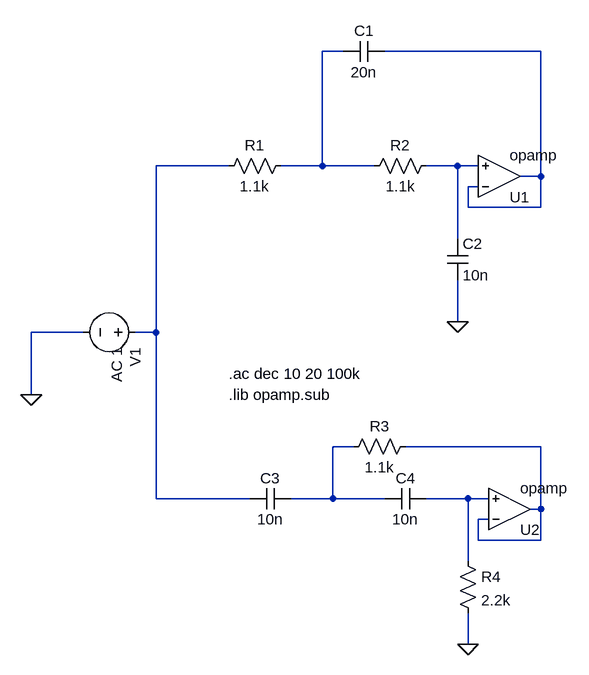
[diagram p0: schematic LTspice_LR2_tb.asc]
LTspice_LR2_tb.asc, the LTspice schematic file:
Version 4.1
SHEET 1 880 680
WIRE -272 -1008 -304 -1008
WIRE 32 -1008 -208 -1008
WIRE -448 -832 -560 -832
WIRE -304 -832 -304 -1008
WIRE -304 -832 -368 -832
WIRE -224 -832 -304 -832
WIRE -96 -832 -144 -832
WIRE -64 -832 -96 -832
WIRE 32 -816 32 -1008
WIRE 32 -816 0 -816
WIRE -64 -800 -80 -800
WIRE -80 -768 -80 -800
WIRE 32 -768 32 -816
WIRE 32 -768 -80 -768
WIRE -96 -720 -96 -832
WIRE -96 -592 -96 -656
WIRE -672 -576 -752 -576
WIRE -560 -576 -560 -832
WIRE -560 -576 -592 -576
WIRE -752 -480 -752 -576
WIRE -736 -480 -752 -480
WIRE -256 -400 -288 -400
WIRE 32 -400 -176 -400
WIRE -560 -320 -560 -576
WIRE -416 -320 -560 -320
WIRE -288 -320 -288 -400
WIRE -288 -320 -352 -320
WIRE -208 -320 -288 -320
WIRE -80 -320 -144 -320
WIRE -48 -320 -80 -320
WIRE 32 -304 32 -400
WIRE 32 -304 16 -304
WIRE -48 -288 -64 -288
WIRE -64 -256 -64 -288
WIRE 32 -256 32 -304
WIRE 32 -256 -64 -256
WIRE -80 -224 -80 -320
WIRE -80 -96 -80 -144
FLAG -96 -592 0
FLAG -80 -96 0
FLAG -752 -480 0
SYMBOL OpAmps\\opamp -32 -752 M180
SYMATTR InstName U1
SYMBOL OpAmps\\opamp -16 -240 M180
SYMATTR InstName U2
SYMBOL res -352 -848 R90
WINDOW 0 0 56 VBottom 2
WINDOW 3 32 56 VTop 2
SYMATTR InstName R1
SYMATTR Value 1.1k
SYMBOL cap -208 -1024 R90
WINDOW 0 0 32 VBottom 2
WINDOW 3 32 32 VTop 2
SYMATTR InstName C1
SYMATTR Value 20n
SYMBOL voltage -576 -576 R90
WINDOW 123 24 44 Left 2
WINDOW 39 0 0 Left 0
SYMATTR InstName V1
SYMATTR Value ""
SYMATTR Value2 AC 1
SYMBOL res -128 -848 R90
WINDOW 0 0 56 VBottom 2
WINDOW 3 32 56 VTop 2
SYMATTR InstName R2
SYMATTR Value 1.1k
SYMBOL cap -112 -720 R0
SYMATTR InstName C2
SYMATTR Value 10n
SYMBOL res -160 -416 R90
WINDOW 0 0 56 VBottom 2
WINDOW 3 32 56 VTop 2
SYMATTR InstName R3
SYMATTR Value 1.1k
SYMBOL cap -352 -336 R90
WINDOW 0 0 32 VBottom 2
WINDOW 3 32 32 VTop 2
SYMATTR InstName C3
SYMATTR Value 10n
SYMBOL cap -144 -336 R90
WINDOW 0 0 32 VBottom 2
WINDOW 3 32 32 VTop 2
SYMATTR InstName C4
SYMATTR Value 10n
SYMBOL res -96 -240 R0
SYMATTR InstName R4
SYMATTR Value 2.2k
TEXT -448 -512 Left 2 !.ac dec 10 20 100k
TEXT -448 -480 Left 2 !.lib opamp.sub

The netlist it stands for:
* LTspice_LR2_tb.asc
X§U1 N002 N004 N002 opamp Aol=100K GBW=10Meg  ; pins invin noninvin out
X§U2 N006 N007 N006 opamp Aol=100K GBW=10Meg  ; pins invin noninvin out
R1 N001 N003 1.1k
C1 N002 N001 20n
V1 N003 0 AC 1
R2 N004 N001 1.1k
C2 N004 0 10n
R3 N006 N005 1.1k
C3 N005 N003 10n
C4 N007 N005 10n
R4 N007 0 2.2k
.ac dec 10 20 100k
.lib opamp.sub
.backanno
.end